# Altium schematic sheet 1166V10-3.SchDoc: Half-Bridge Phase 2
size A3; Author: M. Kutzsche; Organization: Kübrich Ing.-Gesellschaft; Address1: mbH & Co. KG; Address2: Weißmühle 10; Address3: D-96170 Priesendorf; DocumentNumber: UltraZohm; Revision: 10; SheetNumber: 3; SheetTotal: 5
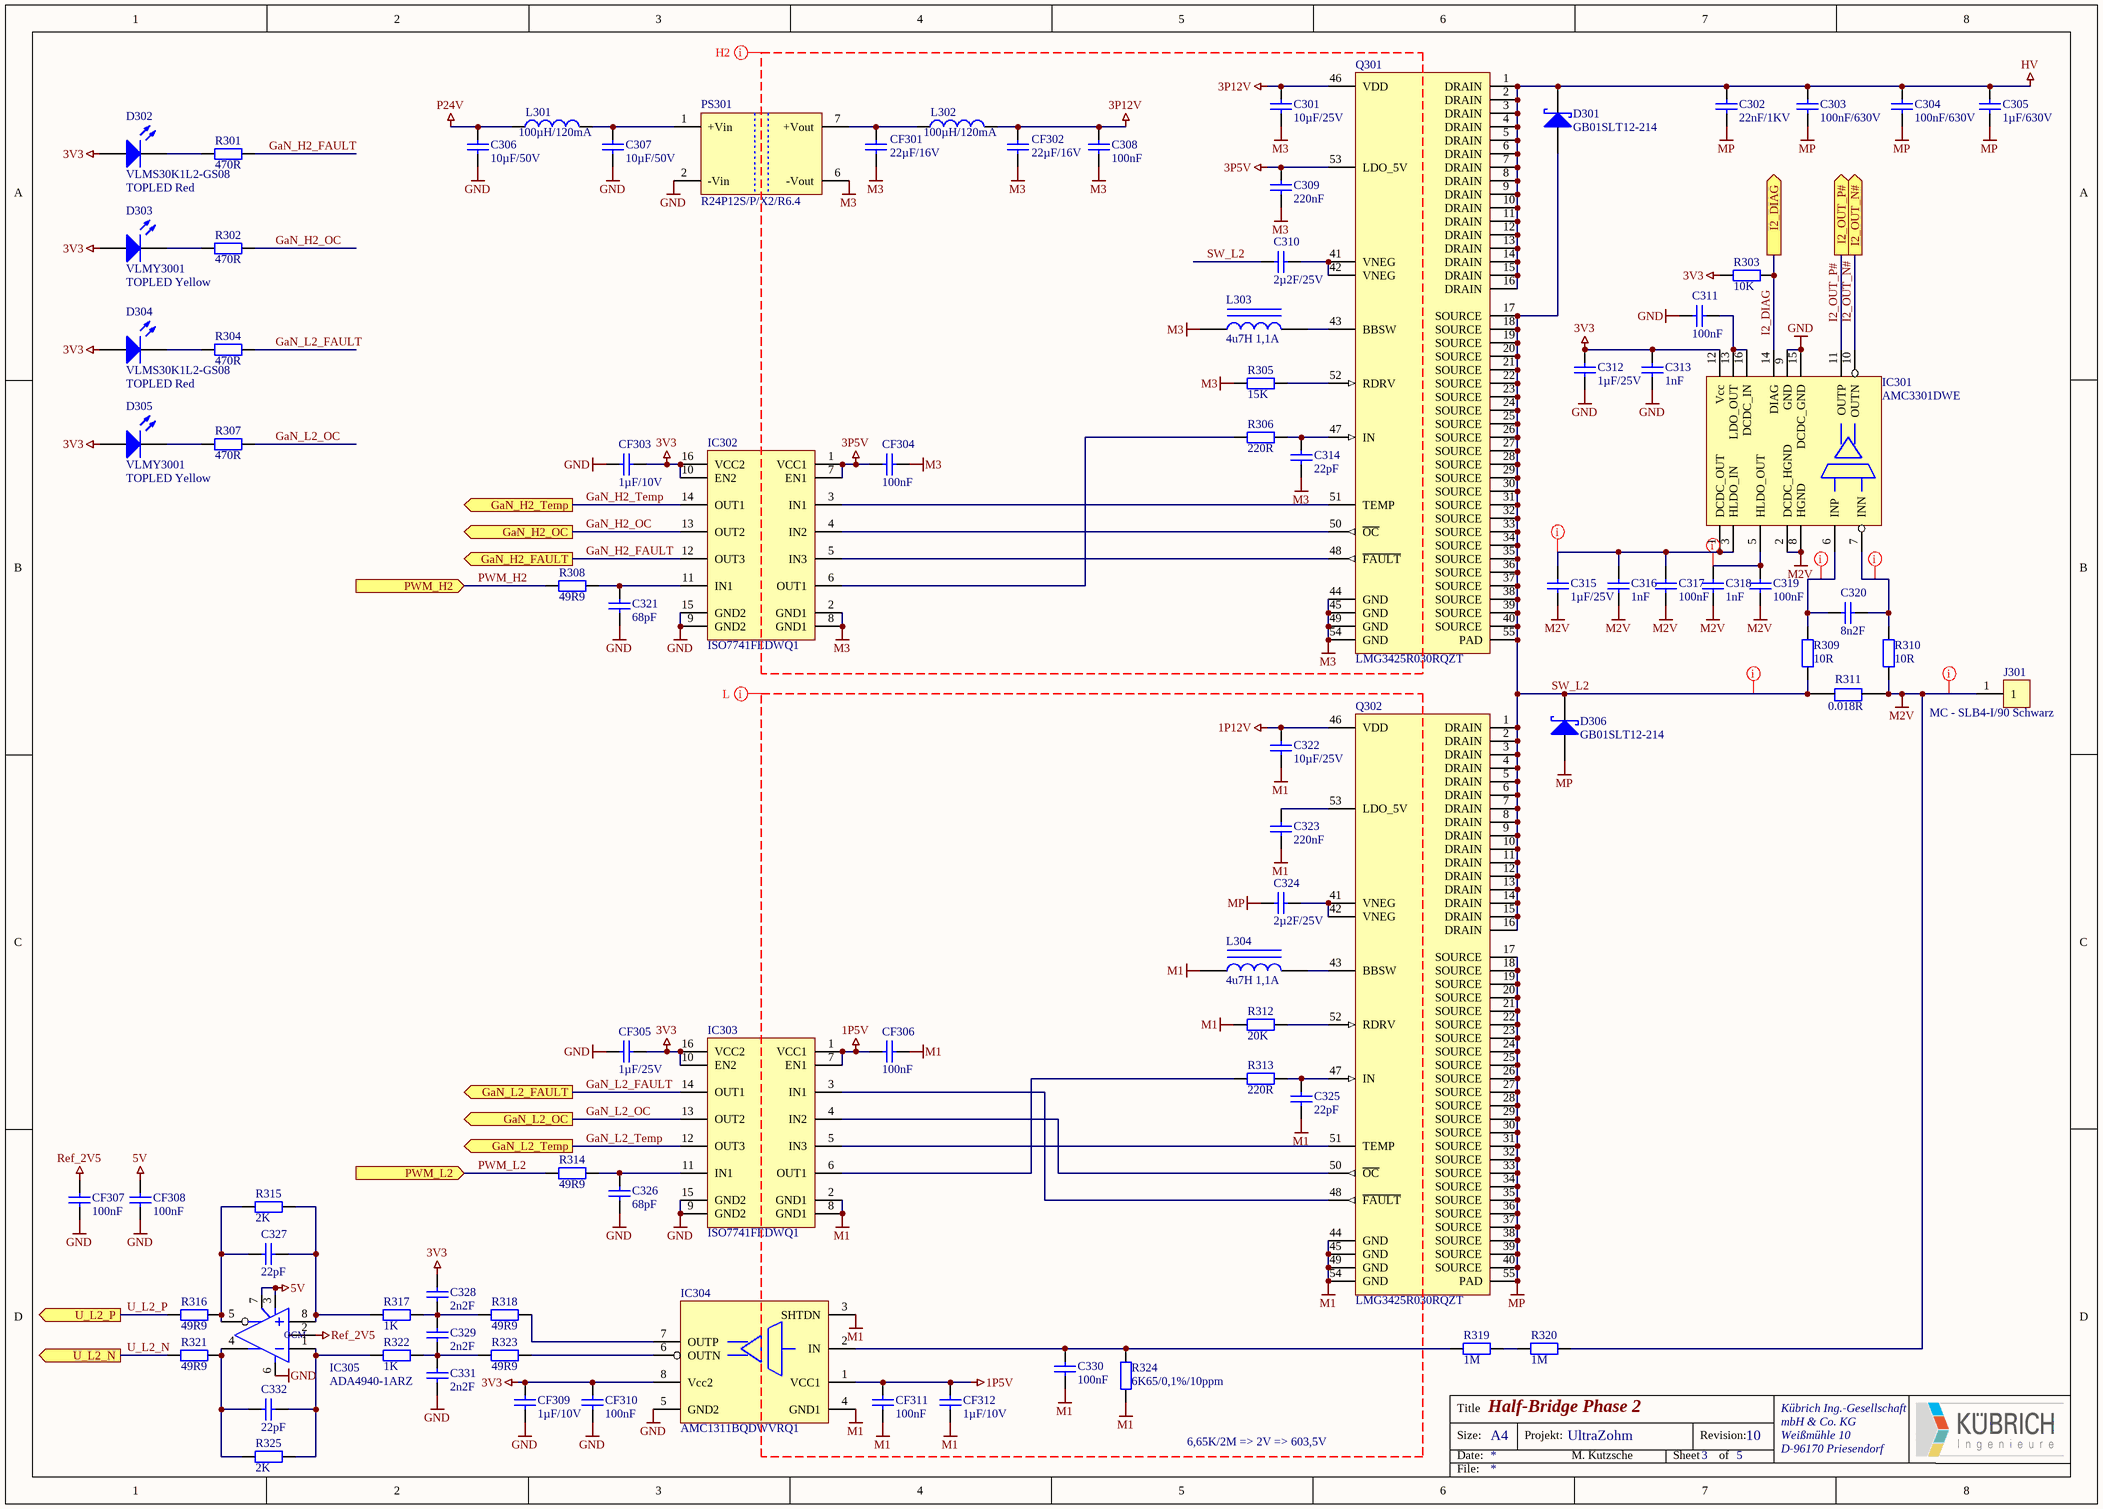
[diagram p0: 1166V10-3.SchDoc]

## Parts
C301  10µF/25V  [0805-Cap]
C302  22nF/1KV  [2220-Cap]
C303  100nF/630V  [2220-Cap]
C304  100nF/630V  [2220-Cap]
C305  1µF/630V  [2220-Cap]
C306  10µF/50V  [1206-Cap]
C307  10µF/50V  [1206-Cap]
C308  100nF  [0603-Cap]
C309  220nF  [0603-Cap]
C310  2µ2F/25V  [0805-Cap]
C311  100nF  [0603-Cap]
C312  1µF/25V  [1206-Cap]
C313  1nF  [1206-Cap]
C314  22pF  [0603-Cap]
C315  1µF/25V  [0603-Cap]
C316  1nF  [0603-Cap]
C317  100nF  [0603-Cap]
C318  1nF  [1206-Cap]
C319  100nF  [1206-Cap]
C320  8n2F  [0603-Cap]
C321  68pF  [0603-Cap]
C322  10µF/25V  [0805-Cap]
C323  220nF  [0603-Cap]
C324  2µ2F/25V  [0805-Cap]
C325  22pF  [0603-Cap]
C326  68pF  [0603-Cap]
C327  22pF  [0603-Cap]
C328  2n2F  [0603-Cap]
C329  2n2F  [0603-Cap]
C330  100nF  [0603-Cap]
C331  2n2F  [0603-Cap]
C332  22pF  [0603-Cap]
CF301  22µF/16V  [0805-Cap]
CF302  22µF/16V  [0805-Cap]
CF303  1µF/10V  [0603-Cap]
CF304  100nF  [0603-Cap]
CF305  1µF/25V  [0603-Cap]
CF306  100nF  [0603-Cap]
CF307  100nF  [0603-Cap]
CF308  100nF  [0603-Cap]
CF309  1µF/10V  [0603-Cap]
CF310  100nF  [0603-Cap]
CF311  100nF  [0603-Cap]
CF312  1µF/10V  [0603-Cap]
D301  GB01SLT12-214  [DO-214 (SMB)]
D302  VLMS30K1L2-GS08  Class II: TOPLED Red  [PLCC-2_rot]
D303  VLMY3001  Class II: TOPLED Yellow  [PLCC-2_gelb]
D304  VLMS30K1L2-GS08  Class II: TOPLED Red  [PLCC-2_rot]
D305  VLMY3001  Class II: TOPLED Yellow  [PLCC-2_gelb]
D306  GB01SLT12-214  [DO-214 (SMB)]
IC301  AMC3301DWE  [SOIC-16-W - 8.1mm]
IC302  ISO7741FEDWQ1  [SOIC-16-W - 8.1mm]
IC303  ISO7741FEDWQ1  [SOIC-16-W - 8.1mm]
IC304  AMC1311BQDWVRQ1  [SOIC-8-W]
IC305  ADA4940-1ARZ  [SOIC-8-N]
J301  MC - SLB4-I/90 Schwarz  [SLB4-I/90 - 4mm]
L301  100µH/120mA  [1007-IND (2518)]
L302  100µH/120mA  [1007-IND (2518)]
L303  4u7H 1,1A  [2.0mm x 1.6mm]
L304  4u7H 1,1A  [2.0mm x 1.6mm]
PS301  R24P12S/P/X2/R6.4  [SIP-7 Single - X2]
Q301  LMG3425R030RQZT  [VQFN-54 (RQZ0054)]
Q302  LMG3425R030RQZT  [VQFN-54 (RQZ0054)]
R301  470R  [0603-Res]
R302  470R  [0603-Res]
R303  10K  [0603-Res]
R304  470R  [0603-Res]
R305  15K  [0603-Res]
R306  220R  [0603-Res]
R307  470R  [0603-Res]
R308  49R9  [0603-Res]
R309  10R  [0603-Res]
R310  10R  [0603-Res]
R311  0.018R  [2512]
R312  20K  [0603-Res]
R313  220R  [0603-Res]
R314  49R9  [0603-Res]
R315  2K  [0603-Res]
R316  49R9  [0603-Res]
R317  1K  [0603-Res]
R318  49R9  [0603-Res]
R319  1M  [2512-Res]
R320  1M  [2512-Res]
R321  49R9  [0603-Res]
R322  1K  [0603-Res]
R323  49R9  [0603-Res]
R324  6K65/0,1%/10ppm  [0603-Res]
R325  2K  [0603-Res]

## Ports
GaN_H2_FAULT (out), GaN_H2_OC (out), GaN_H2_Temp (out), GaN_L2_FAULT (out), GaN_L2_OC (out), GaN_L2_Temp (out), I2_DIAG (out), I2_OUT_N# (out), I2_OUT_P# (out), PWM_H2 (in), PWM_L2 (in), U_L2_N (out), U_L2_P (out)

## Nets
1P5V: CF306.2 CF311.1 CF312.1 IC303.1(VCC1) IC303.7(EN1) IC304.1(VCC1)
1P12V: C322.2 Q302.46(VDD)
3P5V: C309.2 CF304.2 IC302.1(VCC1) IC302.7(EN1) Q301.53(LDO_5V)
3P12V: C301.2 C308.1 CF302.1 L302.2 Q301.46(VDD)
3V3: C312.1 C313.1 C328.2 CF303.1 CF305.1 CF309.1 CF310.1 D302.1(A) D303.1(A) D304.1(A) D305.1(A) IC301.12(Vcc) IC302.10(EN2) IC302.16(VCC2) IC303.10(EN2) IC303.16(VCC2) IC304.8(Vcc2) R303.2
5V: CF308.1 IC305.3(V+) IC305.7(EN)
GND: C306.1 C307.1 C311.1 C312.2 C313.2 C321.1 C326.1 C331.1 CF303.2 CF305.2 CF307.2 CF308.2 CF309.2 CF310.2 IC301.9(GND) IC301.15(DCDC_GND) IC302.9(GND2) IC302.15(GND2) IC303.9(GND2) IC303.15(GND2) IC304.5(GND2) IC305.6(V-) PS301.2(-Vin)
HV: C302.1 C303.1 C304.1 C305.1 D301.2(K) Q301.1(DRAIN) Q301.2(DRAIN) Q301.3(DRAIN) Q301.4(DRAIN) Q301.5(DRAIN) Q301.6(DRAIN) Q301.7(DRAIN) Q301.8(DRAIN) Q301.9(DRAIN) Q301.10(DRAIN) Q301.11(DRAIN) Q301.12(DRAIN) Q301.13(DRAIN) Q301.14(DRAIN) Q301.15(DRAIN) Q301.16(DRAIN)
M1: C322.1 C323.1 C325.1 C330.1 CF306.1 CF311.2 CF312.2 IC303.2(GND1) IC303.8(GND1) IC304.3(SHTDN) IC304.4(GND1) L304.1 Q302.44(GND) Q302.45(GND) Q302.49(GND) Q302.54(GND) R312.2 R324.2
M2V: C315.2 C316.2 C317.2 C318.2 C319.2 IC301.2(DCDC_HGND) IC301.8(HGND) J301.1 R310.1 R311.2 R320.2
M3: C301.1 C308.2 C309.1 C314.1 CF301.2 CF302.2 CF304.1 IC302.2(GND1) IC302.8(GND1) L303.1 PS301.6(-Vout) Q301.44(GND) Q301.45(GND) Q301.49(GND) Q301.54(GND) R305.2
MP: C302.2 C303.2 C304.2 C305.2 C324.2 D306.1(A) Q302.17(SOURCE) Q302.18(SOURCE) Q302.19(SOURCE) Q302.20(SOURCE) Q302.21(SOURCE) Q302.22(SOURCE) Q302.23(SOURCE) Q302.24(SOURCE) Q302.25(SOURCE) Q302.26(SOURCE) Q302.27(SOURCE) Q302.28(SOURCE) Q302.29(SOURCE) Q302.30(SOURCE) Q302.31(SOURCE) Q302.32(SOURCE) Q302.33(SOURCE) Q302.34(SOURCE) Q302.35(SOURCE) Q302.36(SOURCE) Q302.37(SOURCE) Q302.38(SOURCE) Q302.39(SOURCE) Q302.40(SOURCE) Q302.55(PAD)
P24V: C306.2 L301.1
Ref_2V5: CF307.1 IC305.2(OCM)
GaN_H2_FAULT: IC302.12(OUT3) R301.2 ; port GaN_H2_FAULT
GaN_H2_OC: IC302.13(OUT2) R302.2 ; port GaN_H2_OC
GaN_H2_Temp: IC302.14(OUT1) ; port GaN_H2_Temp
GaN_L2_FAULT: IC303.14(OUT1) R304.2 ; port GaN_L2_FAULT
GaN_L2_OC: IC303.13(OUT2) R307.2 ; port GaN_L2_OC
GaN_L2_Temp: IC303.12(OUT3) ; port GaN_L2_Temp
I2_DIAG: IC301.14(DIAG) R303.1 ; port I2_DIAG
I2_OUT_N#: IC301.10(OUTN) ; port I2_OUT_N#
I2_OUT_P#: IC301.11(OUTP) ; port I2_OUT_P#
PWM_H2: R308.2 ; port PWM_H2
PWM_L2: R314.2 ; port PWM_L2
SW_L2: C310.2 D301.1(A) D306.2(K) Q301.17(SOURCE) Q301.18(SOURCE) Q301.19(SOURCE) Q301.20(SOURCE) Q301.21(SOURCE) Q301.22(SOURCE) Q301.23(SOURCE) Q301.24(SOURCE) Q301.25(SOURCE) Q301.26(SOURCE) Q301.27(SOURCE) Q301.28(SOURCE) Q301.29(SOURCE) Q301.30(SOURCE) Q301.31(SOURCE) Q301.32(SOURCE) Q301.33(SOURCE) Q301.34(SOURCE) Q301.35(SOURCE) Q301.36(SOURCE) Q301.37(SOURCE) Q301.38(SOURCE) Q301.39(SOURCE) Q301.40(SOURCE) Q301.55(PAD) Q302.1(DRAIN) Q302.2(DRAIN) Q302.3(DRAIN) Q302.4(DRAIN) Q302.5(DRAIN) Q302.6(DRAIN) Q302.7(DRAIN) Q302.8(DRAIN) Q302.9(DRAIN) Q302.10(DRAIN) Q302.11(DRAIN) Q302.12(DRAIN) Q302.13(DRAIN) Q302.14(DRAIN) Q302.15(DRAIN) Q302.16(DRAIN) R309.1 R311.1
U_L2_N: R321.2 ; port U_L2_N
U_L2_P: R316.2 ; port U_L2_P
NetC307_2: C307.2 L301.2 PS301.1(+Vin)
NetC310_1: C310.1 Q301.41(VNEG) Q301.42(VNEG)
NetC311_2: C311.2 IC301.13(LDO_OUT) IC301.16(DCDC_IN)
NetC314_2: C314.2 Q301.47(IN) R306.1
NetC315_1: C315.1 C316.1 C317.1 IC301.1(DCDC_OUT) IC301.3(HLDO_IN)
NetC318_1: C318.1 C319.1 IC301.5(HLDO_OUT)
NetC320_1: C320.1 IC301.7(INN) R310.2
NetC320_2: C320.2 IC301.6(INP) R309.2
NetC321_2: C321.2 IC302.11(IN1) R308.1
NetC323_2: C323.2 Q302.53(LDO_5V)
NetC324_1: C324.1 Q302.41(VNEG) Q302.42(VNEG)
NetC325_2: C325.2 Q302.47(IN) R313.1
NetC326_2: C326.2 IC303.11(IN1) R314.1
NetC327_1: C327.1 IC305.8(+) R315.1 R317.2
NetC327_2: C327.2 IC305.5(Out) R315.2 R316.1
NetC328_1: C328.1 C329.2 R317.1 R318.2
NetC329_1: C329.1 C331.2 R322.1 R323.2
NetC330_2: C330.2 IC304.2(IN) R319.1 R324.1
NetC332_1: C332.1 IC305.1(-) R322.2 R325.1
NetC332_2: C332.2 IC305.4(Out) R321.1 R325.2
NetCF301_1: CF301.1 L302.1 PS301.7(+Vout)
NetD302_2: D302.2(K) R301.1
NetD303_2: D303.2(K) R302.1
NetD304_2: D304.2(K) R304.1
NetD305_2: D305.2(K) R307.1
NetIC302_3: IC302.3(IN1) Q301.51(TEMP)
NetIC302_4: IC302.4(IN2) Q301.50(~{OC})
NetIC302_5: IC302.5(IN3) Q301.48(~{FAULT})
NetIC302_6: IC302.6(OUT1) R306.2
NetIC303_3: IC303.3(IN1) Q302.48(~{FAULT})
NetIC303_4: IC303.4(IN2) Q302.50(~{OC})
NetIC303_5: IC303.5(IN3) Q302.51(TEMP)
NetIC303_6: IC303.6(OUT1) R313.2
NetIC304_6: IC304.6(OUTN) R323.1
NetIC304_7: IC304.7(OUTP) R318.1
NetL303_2: L303.2 Q301.43(BBSW)
NetL304_2: L304.2 Q302.43(BBSW)
NetQ301_52: Q301.52(RDRV) R305.1
NetQ302_52: Q302.52(RDRV) R312.1
NetR319_2: R319.2 R320.1

## Layout directives
net class H2: 3P5V, 3P12V, M2V, M3, NetC315_1, NetC318_1, NetC320_1, NetC320_2, SW_L2
net class L: 1P5V, 1P12V, M1, MP

## Notes on the sheet
- 6,65K/2M => 2V => 603,5V
- Title
- Size:
- Date:
- A4
- Projekt:
- Sheet
- Revision:
- of
- File:

## Library data of the parts
C301-C332 CF301-CF312 = Cap_SMD: Capacitor (SMD); Class I: Pasiv; Class II: Capacitor; Last edited: 20.11.2006 10:25
  C301 C322: value: 10µF/25V
  C302: value: 22nF/1KV
  C303 C304: value: 100nF/630V
  C305: value: 1µF/630V
  C306 C307: value: 10µF/50V
  C308 C311 C317 C319 C330 CF304 CF306-CF308 CF310 CF311: value: 100nF
  C309 C323: value: 220nF
  C310 C324: value: 2µ2F/25V
  C312 C315 CF305: value: 1µF/25V
  C313 C316 C318: value: 1nF
  C314 C325 C327 C332: value: 22pF
  C320: value: 8n2F
  C321 C326: value: 68pF
  C328 C329 C331: value: 2n2F
  CF301 CF302: value: 22µF/16V
  CF303 CF309 CF312: value: 1µF/10V
D301 D306 = GB01SLT12-214: Silicon Carbide Schottky Diode Vr=1200V If=1A; Manufacturer: GeneSiC Semiconductor; Class I: Discret; Package information: Unknown; Best.-Nr.: DigiKey: 1242-1169-1-ND; Class II: Silicon Carbide Schottky Diode Vr=1200V If=1A; Datasheet: Ver. 7 Nov 2000; Package reference: DO-214AA (SMB)
D302 D304 = VLMS30K1L2-GS08: Top LED Super red, 2mA, 18mcd, -40-100°C; Manufacturer: Vishay; Class I: Discrete; Best.-Nr.: Farnell 132-8349; Last edited: 23.01.2007 08:58
D303 D305 = VLMY3001: Top LED Yellow, 2mA, 18mcd, -40-100°C; Manufacturer: Vishay; Class I: Discrete; Best.-Nr.: ???; Last edited: 23.01.2007 08:58
IC301 = AMC3301DWE: ±250 mV Input Voltage Range, Reinforced Isolated Amplifier and High Bandwidth of 300 kHz; Manufacturer: Texas Instruments; Class II: ±250 mV, 300KHz, -40-125°C; Package information: Unknown; Best.-Nr.: DigiKey: 296-AMC3301DWE-ND; Class I: Isolated Amplifier; Datasheet: Unknown; Package reference: SOIC-16-W
IC302 IC303 = ISO7741FEDWQ1: Quad-CH 100Mbps Isolators 1 IN/3 OUT, 5000V Reinforced, (-40-150°C); Manufacturer: Anaolog Devices; Class I: Optocoupler; Package information: Unknown; Best.-Nr.: DigiKey: 296-ISO7741FEDWQ1-ND; Class II: Quad-CH 100Mbps Isolators 1 IN/3 OUT, 5000V Reinforced, (-40-150°C); Datasheet: Unknown; Package reference: SOIC-16W
IC304 = AMC1311BQDWVRQ1: 2V Input, Automotive High-Impedance, Reinforced Isolated Amplifier for Voltage Sensing; Manufacturer: Texas Instruments; Class II: 2V, 275KHz, -40-125°C; Package information: Unknown; Best.-Nr.: Mouser: 595-AMC1311BQDWVRQ1; Class I: Isolated Amplifier; Datasheet: Unknown; Package reference: SOIC-8-W
IC305 = ADA4940-1ARZ: Fully Differential ADC Drivers (-40-125°C); Manufacturer: ANALOG DEVICES; Class I: Analog; Best.-Nr.: Farnell 209-6178; Class II: Fully Differential ADC Drivers (-40-125°C); Datasheet: DSO11449, Ver. Aug 2000; Last edited: 04.01.2007 10:14; Package Reference: SOIC-N-8
J301 = MC - SLB4-I/90 Schwarz: Labor Winkelbuchsen 4mm Schwarz; Manufacturer: Multi-Contact; Class I: Connectors; Best.-Nr.: Farnell: 108-5521; Class II: Labor Winkelbuchsen 4mm Schwarz; Last edited: 07.03.2007 13:28
L301 L302 = CB2518T101K: 100µH, 60/120mA. (1007), -40-105°C; Manufacturer: Taiyo Yuden; Class I: Pasive; Best.-Nr.: DigiKey:   587-2192-1-ND; Class II: 100µH, 60/120mA. (1007), -40-105°C; Last edited: 08.12.2006 12:28
L303 L304 = SDEM20161T-4R7MS: Power Choke 4u7H 1,1A; Manufacturer: Delta Electronics/Cyntec; Class I: Pasive; Best.-Nr.: DigiKey: 2037-SDEM20161T-4R7MSCT-ND; Class II: Power Choke 4u7H 1,1A; Last edited: 15.03.2007 11:19
PS301 = R24P12S/P/X2/R6.4: DC/DC Converter 24V to 12V, 1W, 84mA (unregulated) 6,4KVDC Rainforced; Manufacturer: Recom; Class I: Analog; Package information: Unknown; Best.-Nr.: Mouser: 919-R24P12SX2PR6.4; Class II: DC/DC Converter 24V to 12V, 1W, 84mA (unregulated) 6,4KVDC Rainforced; Package reference: SIP-7; Datasheet: Rev. 28 Apr 2002
Q301 Q302 = LMG3425R030RQZT: GaN FET Power Stage With Cycle-by-cycle Overcurrent Protection 600V/40A/30mOhm; Manufacturer: Texas Instruments; Class I: Discret; Package information: Unknown; Best.-Nr.: TI-Shop; Class II: GaN FET Power Stage With Cycle-by-cycle Overcurrent Protection 600V/40A/30mOhm; Datasheet: LMG3425R030; Package reference: VQFN-32
R301-R310 R312-R318 R321-R325 = Res_SMD: Resistor SMD; Class I: Pasiv; Class II: Resistor; Last edited: 17.11.2006 11:38
  R301 R302 R304 R307: value: 470R
  R303: value: 10K
  R305: value: 15K
  R306 R313: value: 220R
  R308 R314 R316 R318 R321 R323: value: 49R9
  R309 R310: value: 10R
  R312: value: 20K
  R315 R325: value: 2K
  R317 R322: value: 1K
  R324: value: 6K65/0,1%/10ppm
R311 = MCLRP12DTDRR018: 18mOhm, 3W, 0,5%, 50ppm/°C; Manufacturer: Milticomp; Class I: Pasiv; Class II: Shunt 3W; Best.-Nr.: Farnell: 282-8111; Last edited: 23.11.2010 14:12; value: 0.018R
R319 R320 = HVCB2512BDE1M00: Resistor SMD 1M/0,1%/3KV/2W/25ppm/°C; Class I: Pasiv; Best.-Nr.: DigiKey: HVCB2512BDE1M00CT-ND; Class II: Resistor; Last edited: 17.11.2006 11:38; value: 1M